# Altium schematic sheet 1_ADSTM32-Power.SchDoc: USB C Connector and Buck Converter
size A; SheetNumber: 2; SheetTotal: 4
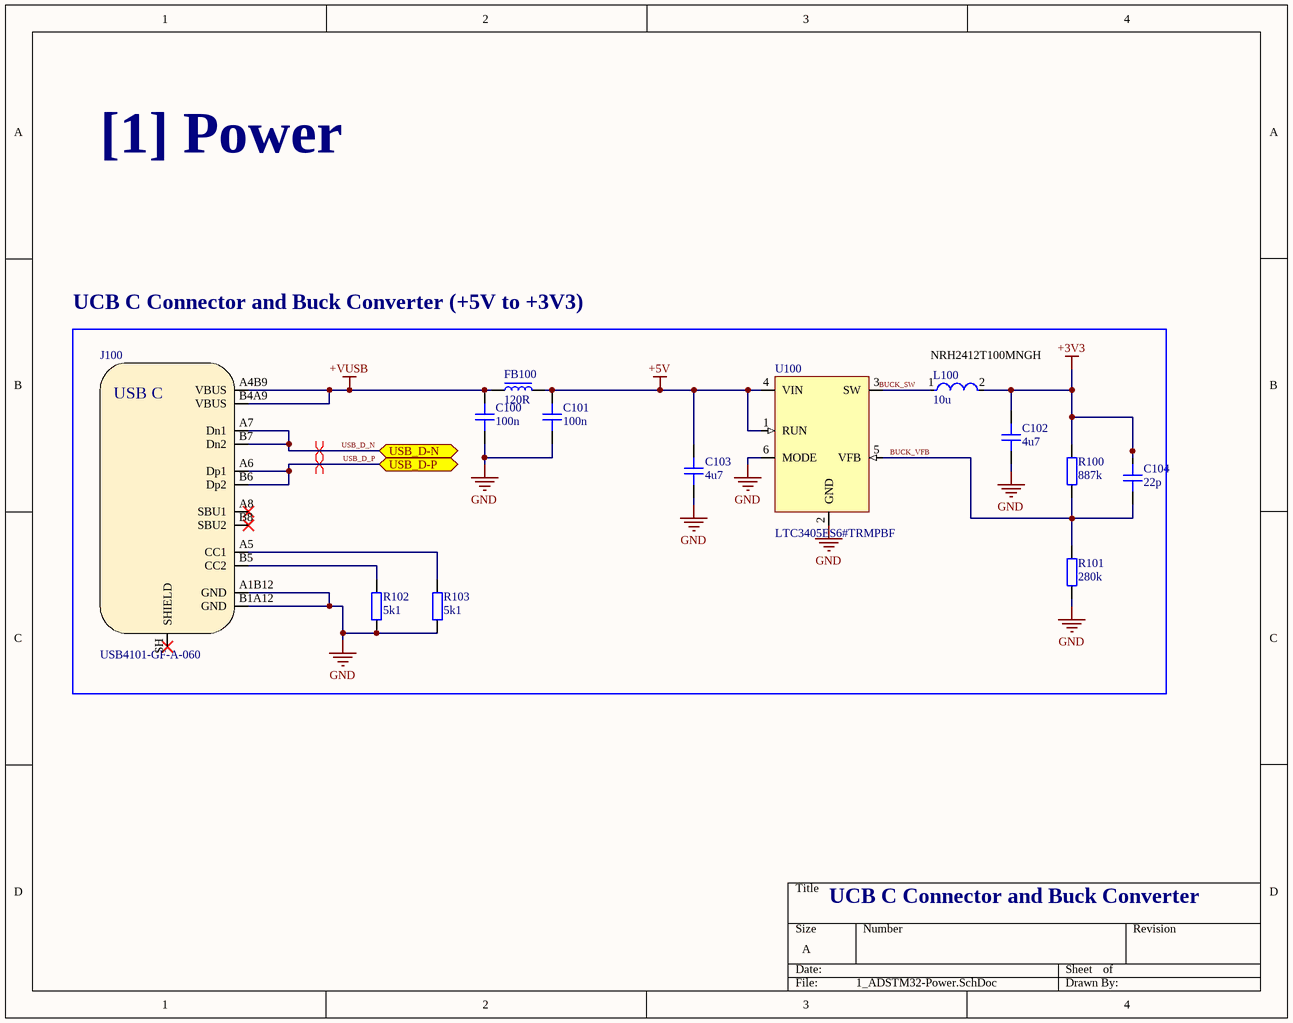
[diagram p0: 1_ADSTM32-Power.SchDoc]

## Parts
C100  100n  [CAP_0603]
C101  100n  [CAP_0603]
C102  4u7  [CAP_0805]
C103  4u7  [CAP_0805]
C104  22p  [CAP_0603]
FB100  120R  [FB_0603]
J100  USB4101-GF-A-060  [USB4105-GF-A-060]
L100  10u  [FP-NRH2412-MFG]
R100  887k  [RES_0603]
R101  280k  [RES_0603]
R102  5k1  [RES_0603]
R103  5k1  [RES_0603]
U100  LTC3405ES6#TRMPBF  [SOT-23-6]

## Ports
USB_D-N (bidir, see 0_ADSTM32-Overview[2B], 2_ADSTM32-MCU[2B]), USB_D-P (bidir, see 0_ADSTM32-Overview[2B], 2_ADSTM32-MCU[2B])

## Nets
+3V3: C102.2 C104.2 L100.2 R100.2
+5V: C101.2 C103.2 FB100.2 U100.1(RUN) U100.4(VIN)
+VUSB: C100.2 FB100.1 J100.A4B9(VBUS) J100.B4A9(VBUS)
GND: C100.1 C101.1 C102.1 C103.1 J100.A1B12(GND) J100.B1A12(GND) R101.1 R102.1 R103.1 U100.2(GND) U100.6(MODE)
BUCK_SW: L100.1 U100.3(SW)
BUCK_VFB: C104.1 R100.1 R101.2 U100.5(VFB)
USB_D_N: J100.A7(Dn1) J100.B7(Dn2) ; port USB_D-N
USB_D_P: J100.A6(Dp1) J100.B6(Dp2) ; port USB_D-P
NetJ100_A5: J100.A5(CC1) R103.2
NetJ100_B5: J100.B5(CC2) R102.2

Not connected (* = marked no-connect by the designer): J100 A8(SBU1)* B8(SBU2)* SH(SHIELD)*

## Layout directives
differential pair: USB_D_N, USB_D_P

## Notes on the sheet
- [1] Power
- UCB C Connector and Buck Converter (+5V to +3V3)
- (near L100) NRH2412T100MNGH
- UCB C Connector and Buck Converter
- (in symbol USB4105-GF-A-060) USB C

## Library data of the parts
C100 C101 = CAP_0603: Capaictor SMD 0603 Generic; Manufacturer: *; Manufacturer Part Number: *; Tolerance: *; Voltage Rating: *; Dielectric: *
C102 C103 = CAP_0805_16V: Capacitor SMD 0805 Generic; Voltage Rating: 16V; Manufacturer: *; Manufacturer Part Number: *; Tolerance: *; Dielectric: *
C104 = CAP_0603: Capaictor SMD 0603 Generic; Voltage Rating: 10V; Manufacturer: *; Manufacturer Part Number: *; Tolerance: *; Dielectric: *
FB100 = BMC-Q1JY0120H: Ferrite Beads BMC-Q 0603 120R 25% Tol. High Current; Manufacturer: Bourns; Impedance Value: 120 Ohm @ 100MHz; Rated Current: 1A; DC Resistance: 0.15 Ohm; Manufacturer Part Number: BMC-Q1JY0120H; Package: 0603; Supplier Link: https://eu.mouser.com/ProductDetail/TE-Connectivity-Sigma-Inductors/BMC-Q1JY0120H?qs=sGAEpiMZZMt1hubY80%2Fs8KH3ycnB7WcGc%2FcSUtObKOLmj4JvfvR2Cw%3D%3D
J100 = USB4105-GF-A-060: USB connector Type C SMT 12 pin; Manufacturer: GCT; Manufacturer Part Number: USB4105-GF-A-060; Distributor Link: https://eu.mouser.com/ProductDetail/GCT/USB4105-GF-A-060?qs=QNEnbhJQKvY2mocwNJzgfA%3D%3D
L100 = CMP-14484-000582-1: Shielded Wirewound Inductor 10uH 20% 0.51A 0.72Ω SMD; DC Resistance (DCR): 600mR; Current Rating: 450mA; Saturation Current: 810mA; Core Material: Ferrite; Test Frequency: 100kHz; Self Resonant Frequency: 29MHz; Termination: SMD/SMT; Shielding: Shielded; Height - Seated (Max): 0.047inch; Case/Package: Nonstandard; Tolerance: 20%; Height: 1.2mm; Package Quantity: 2500; Mount: Surface Mount; Min Operating Temperature: -25°C; Inductance: 10uH; Width: 0.095inch; Length: 0.095inch; RoHS Compliant: Yes; Max DC Current: 810mA; Packaging: Tape and Reel; Max Operating Temperature: 120°C; Halogen Free: Halogen Free
R100 R101 = RES_0603: Resistor SMD 0603 Generic; Tolerance: 1%; Manufacturer: *; Manufacturer Part Number: *; Package Size: *; Voltage Rating: *
R102 R103 = RES_0603: Resistor SMD 0603 Generic; Manufacturer: *; Manufacturer Part Number: *; Tolerance: *; Package Size: *; Voltage Rating: *
U100 = LTC3405ES6#TRMPBF: 1.5MHz, 300mA Synchronous Step-Down Regulator in ThinSOT; Manufacturer: Analog Devices; Panufacturer Part Number: LTC3405ES6#TRMPBF